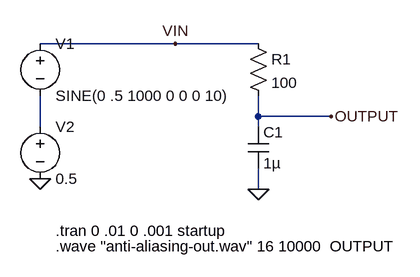
[diagram p0: schematic anti-aliasing-filter.asc]
anti-aliasing-filter.asc, the LTspice schematic file:
Version 4
SHEET 1 880 680
WIRE -48 64 -256 64
WIRE 80 64 -48 64
WIRE 80 176 80 144
WIRE 192 176 80 176
WIRE -256 192 -256 144
WIRE 80 192 80 176
WIRE 80 288 80 256
FLAG 192 176 OUTPUT
FLAG 80 288 0
FLAG -256 272 0
FLAG -48 64 VIN
SYMBOL res 64 48 R0
SYMATTR InstName R1
SYMATTR Value 100
SYMATTR SpiceLine tol=1 pwr=0.1
SYMBOL cap 64 192 R0
SYMATTR InstName C1
SYMATTR Value 1µ
SYMATTR SpiceLine V=4 Irms=0 Rser=0 Lser=0 mfg="Murata" pn="GRM152R60G105ME15" type="X5R"
SYMBOL voltage -256 48 R0
WINDOW 123 0 0 Left 0
WINDOW 39 0 0 Left 0
SYMATTR InstName V1
SYMATTR Value SINE(0 .5 1000 0 0 0 10)
SYMBOL voltage -256 176 R0
WINDOW 123 0 0 Left 0
WINDOW 39 0 0 Left 0
SYMATTR InstName V2
SYMATTR Value 0.5
TEXT -232 352 Left 2 !.tran 0 .01 0 .001 startup
TEXT -232 376 Left 2 !.wave "anti-aliasing-out.wav" 16 10000  OUTPUT

The netlist it stands for:
* anti-aliasing-filter.asc
R1 VIN OUTPUT 100 tol=1 pwr=0.1
C1 OUTPUT 0 1µ V=4 Irms=0 Rser=0 Lser=0 mfg="Murata" pn="GRM152R60G105ME15" type="X5R"
V1 VIN N001 SINE(0 .5 1000 0 0 0 10)
V2 N001 0 0.5
.tran 0 .01 0 .001 startup
.wave "anti-aliasing-out.wav" 16 10000  OUTPUT
.backanno
.end